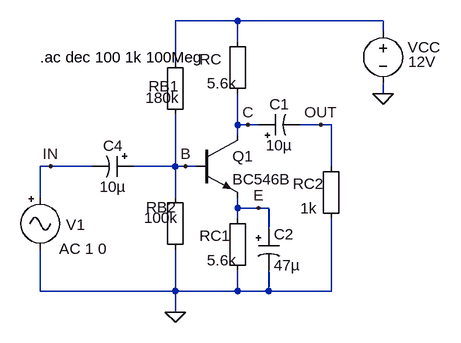
[diagram p0: schematic BJT_CE_AC.asc]
BJT_CE_AC.asc, the LTspice schematic file:
Version 4.1
SHEET 1 880 680
WIRE 192 -64 96 -64
WIRE 416 -64 192 -64
WIRE 416 -48 416 -64
WIRE 192 -32 192 -64
WIRE 96 0 96 -64
WIRE 416 48 416 32
WIRE 192 96 192 48
WIRE 208 96 192 96
WIRE 224 96 208 96
WIRE 320 96 288 96
WIRE 336 96 320 96
WIRE 192 112 192 96
WIRE -96 160 -112 160
WIRE -32 160 -96 160
WIRE 96 160 96 80
WIRE 96 160 32 160
WIRE 112 160 96 160
WIRE 128 160 112 160
WIRE 336 160 336 96
WIRE -112 208 -112 160
WIRE 96 208 96 160
WIRE 192 224 192 208
WIRE 224 224 192 224
WIRE 240 224 224 224
WIRE 192 240 192 224
WIRE 240 256 240 224
WIRE -112 352 -112 288
WIRE 96 352 96 288
WIRE 96 352 -112 352
WIRE 192 352 192 320
WIRE 192 352 96 352
WIRE 240 352 240 320
WIRE 240 352 192 352
WIRE 336 352 336 240
WIRE 336 352 240 352
WIRE 96 384 96 352
FLAG 416 48 0
FLAG -96 160 IN
FLAG 96 384 0
FLAG 208 96 C
FLAG 112 160 B
FLAG 224 224 E
FLAG 320 96 OUT
SYMBOL npn 128 112 R0
SYMATTR InstName Q1
SYMATTR Value BC546B
SYMBOL Misc\\EuropeanResistor 80 -16 R0
WINDOW 0 -25 53 Left 2
WINDOW 3 -30 70 Left 2
SYMATTR InstName RB1
SYMATTR Value 180k
SYMBOL Misc\\EuropeanResistor 176 -48 R0
WINDOW 0 -43 43 Left 2
WINDOW 3 -31 80 Left 2
SYMATTR InstName RC
SYMATTR Value 5.6k
SYMBOL Misc\\signal -112 192 R0
WINDOW 123 29 95 Left 2
WINDOW 0 40 58 Left 2
WINDOW 3 8 103 Left 2
WINDOW 39 0 0 Left 0
SYMATTR Value2 AC 1 0
SYMATTR InstName V1
SYMATTR Value ""
SYMBOL voltage 416 -64 R0
WINDOW 0 38 41 Left 2
WINDOW 3 39 63 Left 2
WINDOW 123 0 0 Left 2
WINDOW 39 0 0 Left 2
SYMATTR InstName VCC
SYMATTR Value 12V
SYMBOL polcap 32 144 R90
WINDOW 0 0 32 VBottom 2
WINDOW 3 32 32 VTop 2
SYMATTR InstName C4
SYMATTR Value 10µ
SYMATTR Description Capacitor
SYMATTR Type cap
SYMATTR SpiceLine V=12.5 Irms=2.12132 Rser=0.06 Lser=0 mfg="KEMET" pn="A700V106M12RATE060" type="Al electrolytic"
SYMBOL Misc\\EuropeanResistor 176 224 R0
WINDOW 0 -43 43 Left 2
WINDOW 3 -31 80 Left 2
SYMATTR InstName RC1
SYMATTR Value 5.6k
SYMBOL Misc\\EuropeanResistor 80 192 R0
WINDOW 0 -29 31 Left 2
WINDOW 3 -32 47 Left 2
SYMATTR InstName RB2
SYMATTR Value 100k
SYMBOL polcap 224 112 R270
WINDOW 0 32 32 VTop 2
WINDOW 3 0 32 VBottom 2
SYMATTR InstName C1
SYMATTR Value 10µ
SYMATTR Description Capacitor
SYMATTR Type cap
SYMATTR SpiceLine V=35 Irms=65m Rser=0.9 Lser=3.04n mfg="Wьrth Elektronik" pn="860240572001 WCAP-AT1H 5x11" type="Al electrolytic"
SYMBOL polcap 224 256 R0
WINDOW 3 24 56 Left 2
SYMATTR Value 47µ
SYMATTR InstName C2
SYMATTR Description Capacitor
SYMATTR Type cap
SYMATTR SpiceLine V=10 Irms=48m Rser=0.8111 Lser=4.07n mfg="Wьrth Elektronik" pn="865230243003 WCAP-AS5H 6,3x5,5" type="Al electrolytic"
SYMBOL Misc\\EuropeanResistor 320 144 R0
WINDOW 0 -43 43 Left 2
WINDOW 3 -31 80 Left 2
SYMATTR InstName RC2
SYMATTR Value 1k
TEXT -112 -8 Left 2 !.ac dec 100 1k 100Meg

The netlist it stands for:
* BJT_CE_AC.asc
Q1 C B E 0 BC546B
RB1 N001 B 180k
RC N001 C 5.6k
V1 IN 0 AC 1 0
VCC N001 0 12V
C4 B IN 10µ V=12.5 Irms=2.12132 Rser=0.06 Lser=0 mfg="KEMET" pn="A700V106M12RATE060" type="Al electrolytic"
RC1 E 0 5.6k
RB2 B 0 100k
C1 C OUT 10µ V=35 Irms=65m Rser=0.9 Lser=3.04n mfg="Wьrth Elektronik" pn="860240572001 WCAP-AT1H 5x11" type="Al electrolytic"
C2 E 0 47µ V=10 Irms=48m Rser=0.8111 Lser=4.07n mfg="Wьrth Elektronik" pn="865230243003 WCAP-AS5H 6,3x5,5" type="Al electrolytic"
RC2 OUT 0 1k
.model NPN NPN
.model PNP PNP
.lib standard.bjt
.ac dec 100 1k 100Meg
.backanno
.end